# EasyEDA Pro project Button(EasyEDA_PRO).eprj

# Schematic Schematic1
Board Name: Board1; Create Date: 2026-04-25; Page Name: P1; Project Name: Button_QuattroBox; Schematic Name: Schematic1; Update Date: 2026-04-25; Company: EasyEDA.com; Page Size: A4; Version: V1.0
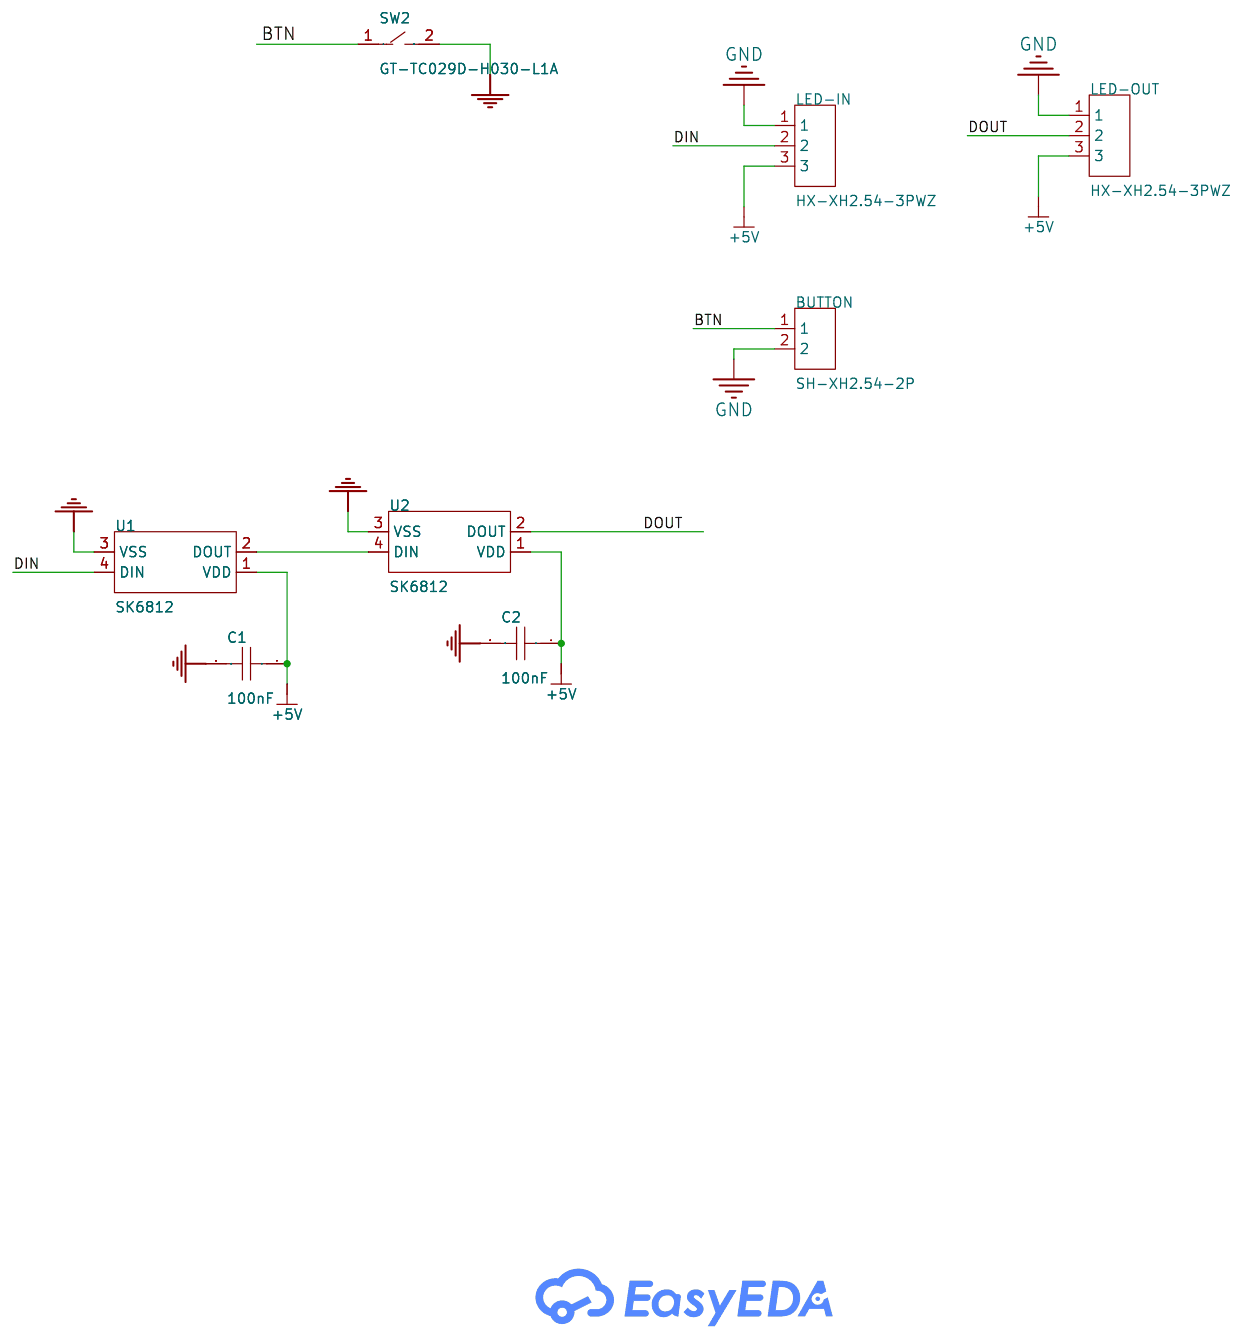
[diagram p0: schematic sheet]

## Parts
BUTTON  SH-XH2.54-2P  [CONN-TH_2P-P2.50-XH2.54-2P]
C1  100nF  [C0603]
C2  100nF  [C0603]
LED-IN  HX-XH2.54-3PWZ  [CONN-TH_3P-P2.50_BX-HA2.54-3PWZ]
LED-OUT  HX-XH2.54-3PWZ  [CONN-TH_3P-P2.50_BX-HA2.54-3PWZ]
SW2  GT-TC029D-H030-L1A  [SW-SMD_GT-TC029D-H030-L1A]
U1  SK6812  [LED-SMD_4P-L5.0-W5.0-LS5.4-TL-1]
U2  SK6812  [LED-SMD_4P-L5.0-W5.0-LS5.4-TL-1]

## Library data of the parts
BUTTON = SH-XH2.54-2P: LCSC Part Name: 1x2P 间距:2.5mm 直插; Supplier Part: C53261323; Manufacturer: 深海电子; Supplier Footprint: 插件,P=2.5mm; JLCPCB Part Class: Extended Part; Datasheet: https://item.szlcsc.com/datasheet/SH-XH2.54-2P/56320007.html; Supplier: LCSC; Pins Structure: 1x2P; Pitch: 2.5mm; Mounting Type: Through Hole; Number of Pins: 2P; Number of Rows: 1; Number of PINs Per Row: 2; Current Rating: 3A; Contact Material: Brass; Contact Plating: Tin; Operating Temperature: -25℃~+85℃; Voltage Rating: 250V; Plastic Material: PA66; Flame Retardant Rating: UL94V-0; Color: White; Z-Height of the Board: 7.1mm; X-Length of Bottom Edge on Board (Spacing Line): 7.5mm; Y-Width of Bottom Edge on Board: 5.8mm
C1 C2 = CAP_0603: Supplier Footprint: 0603
LED-IN LED-OUT = HX-XH2.54-3PWZ: LCSC Part Name: 1x3P 间距:2.5mm 弯插 系列:XH; Supplier Part: C48641715; Manufacturer: hanxia(韩下); Supplier Footprint: 弯插,P=2.5mm; JLCPCB Part Class: Extended Part; Datasheet: https://item.szlcsc.com/datasheet/HX-XH2.54-3PWZ/50919911.html; Supplier: LCSC; Pins Structure: 1x3P; Pitch: 2.5mm; Mounting Type: Right Angle; Reference Series: XH; Number of Pins: 3P; Number of Rows: 1; Number of PINs Per Row: 3; Current Rating: 3A; Contact Material: Brass; Contact Plating: Tin; Operating Temperature: -25℃~+85℃; Voltage Rating: 250V; Plastic Material: PA66; Flame Retardant Rating: UL94V-0; Color: White
SW2 = GT-TC029D-H030-L1A: LCSC Part Name: 立贴轻触开关; Supplier Part: C51939822; Manufacturer: G-Switch(品赞); Supplier Footprint: SMD; JLCPCB Part Class: Extended Part; Datasheet: https://item.szlcsc.com/datasheet/GT-TC029D-H030-L1A/54658607.html; Supplier: LCSC
U1 U2 = SK6812_C5378720: LCSC Part Name: 5.4x5.0x1.6毫米0.2W智能外控表面贴装SMD型LED; Supplier Part: C5378720; Manufacturer: 欧思科光电; Supplier Footprint: SMD-4P,5.4x5mm; JLCPCB Part Class: Extended Part; Datasheet: https://item.szlcsc.com/datasheet/SK6812/6242291.html; Supplier: LCSC; Wavelength: R:620nm~625nm；B:460nm~470nm；G:520nm~530nm; Luminous Intensity: B:160mcd~320mcd；R:280mcd~515mcd；G:815mcd~1275mcd; Fixed-Frequency Pwm Mode: 1kHz; Data Transmission Rate: 800Kbit/s; Voltage - Supply: 3.7V~5.5V; Quiescent Current: 0.6mA; Lens Color: Semi-transparent lens; ESD Withstand Voltage: 2000V; Operating Temperature: -40℃~+85℃; Viewing Angle: 120°; Height: 1.6mm

## Nets
+5V: C1.1 C2.1 LED-IN.3 LED-OUT.3 U1.1(VDD) U2.1(VDD)
GND: BUTTON.2 C1.2 C2.2 LED-IN.1 LED-OUT.1 SW2.2 U1.3(VSS) U2.3(VSS)
BTN: BUTTON.1 SW2.1
DIN: LED-IN.2 U1.4(DIN)
DOUT: LED-OUT.2 U2.2(DOUT)
$1N567: U1.2(DOUT) U2.4(DIN)

# Board PCB2
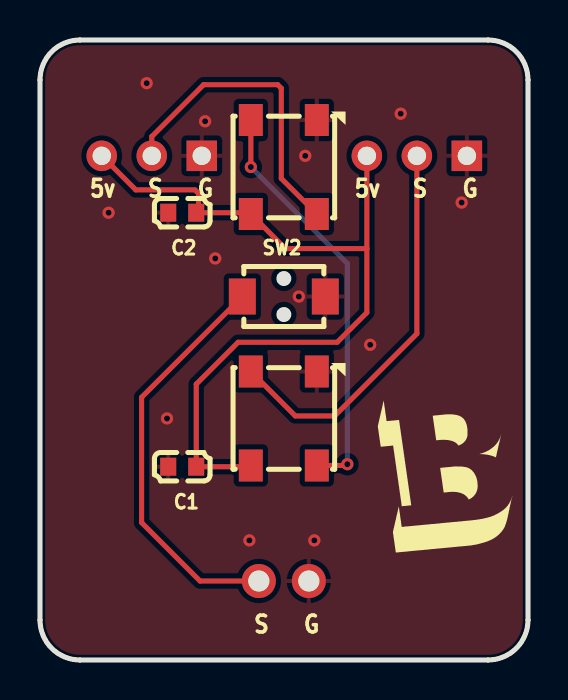
[diagram p1: board, top side]
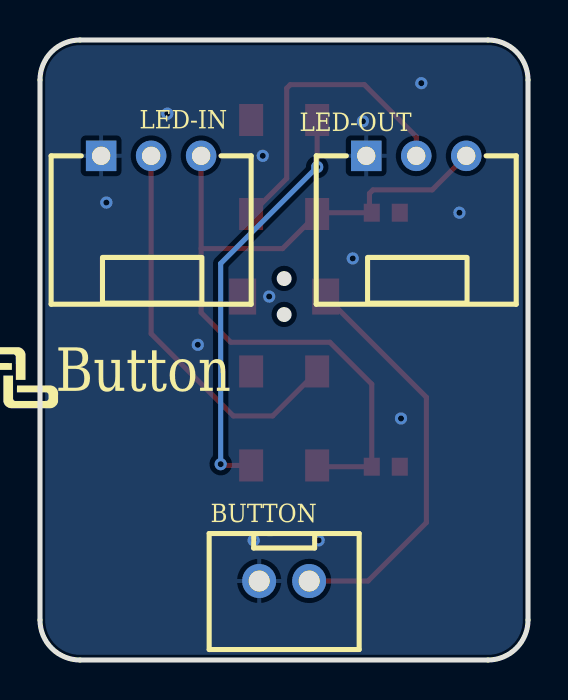
[diagram p2: board, bottom side, seen from below]

Outline 24.4 x 31 mm; copper layers: Top Layer, Bottom Layer. Coordinates in mm from the lower left corner of the outline.
Outline path: 0,29 0,2 arc(0.59,0.59) 2,0 22.4,0 arc(23.81,0.59) 24.4,2 24.4,29 arc(23.81,30.41) 22.4,31 2,31 arc(0.59,30.41) 0,29
Stack: Top Layer 0.035mm / Dielectric1 1.51mm FR4 er 4.5 / Bottom Layer 0.035mm

## Design rules (mm)
template: JLCPCB Capability(Two Layers Board)
spacing copperThickness1oz (default): track to track 0.102, other pairs 0.152 to 0.3
spacing copperThickness2oz: track to track 0.203, other pairs 0.152 to 0.3
track width copperThickness1oz (default): min 0.127, default 0.254, max 2.54
track width copperThickness2oz: min 0.203, default 0.254, max 2.54
differential pair differentialPair (default): width min 0.127, default 0.254, max 2.54; gap min 0.152, default 0.152
via viaSize (default): diameter min 0.5, default 0.61, max 10; hole min 0.3, default 0.305, max 6.3

## Placement (name value [footprint] x y rotation side)
BUTTON  SH-XH2.54-2P  [CONN-TH_2P-P2.50-XH2.54-2P]  12.19 3.95 180 bottom
C1  100nF  [C0603]  7.11 9.66 180 top
C2  100nF  [C0603]  7.11 22.36 180 top
LED-IN  HX-XH2.54-3PWZ  [CONN-TH_3P-P2.50_BX-HA2.54-3PWZ]  18.84 25.21 180 bottom
LED-OUT  HX-XH2.54-3PWZ  [CONN-TH_3P-P2.50_BX-HA2.54-3PWZ]  5.59 25.21 180 bottom
SW2  GT-TC029D-H030-L1A  [SW-SMD_GT-TC029D-H030-L1A]  12.19 18.17 0 top
U1  SK6812  [LED-SMD_4P-L5.0-W5.0-LS5.4-TL-1]  12.19 12.08 90 top
U2  SK6812  [LED-SMD_4P-L5.0-W5.0-LS5.4-TL-1]  12.19 24.65 90 top

## Footprints (pads in the part's own frame, mm; a bottom-side part is the same pattern mirrored in y, then rotated)
C0603
  rect 0.8x0.9 smd: 1(-0.7,0) 2(0.7,0)
CONN-TH_2P-P2.50-XH2.54-2P
  round 1.7 hole 1.05: 1(1.25,0) 2(-1.25,0)
CONN-TH_3P-P2.50_BX-HA2.54-3PWZ
  rect 1.524x1.524 hole 0.914: 1(-2.5,0)
  round 1.524 hole 0.914: 2(0,0) 3(2.5,0)
LED-SMD_4P-L5.0-W5.0-LS5.4-TL-1
  rect 1.6x1.2 smd: 1(-2.35,1.65) 2(-2.35,-1.65) 3(2.35,-1.65) 4(2.35,1.65)
SW-SMD_GT-TC029D-H030-L1A
  rect 1.35x1.8 smd: 1(-2.075,0) 2(2.075,0)

## Nets
As in the schematic.

## Via types
v1: diameter 0.61, hole 0.305, Top Layer to Bottom Layer, 14 vias

## Routing (per net, layer and track width the routed paths; a pad name or vN(x,y) marks a point on that pad's centre or on a via; arc(x,y) is an arc through that point)
+5V: length 40.6
  Top Layer w0.254: U1.1 10.48,9.66 C1.1 7.81,13.79 9.91,15.89 14.86,15.89 16.34,17.37 16.34,20.57 ; 16.34,20.57 12.27,20.57 U2.1 10.48,22.36 C2.1 7.93,22.48 7.93,23.33 7.75,23.51 4.79,23.51 LED-OUT.3 ; 16.34,20.57 LED-IN.3
GND:
  vias: v1(3.43,22.36) v1(5.33,28.84) v1(6.35,12.08) v1(8.25,26.94) v1(8.76,20.08) v1(10.47,5.98) v1(12.94,18.17) v1(13.26,25.21) v1(13.72,5.98) v1(16.51,15.76) v1(18.03,27.32) v1(21.08,22.87)
BTN: length 20.5
  Top Layer w0.254: 10.12,18.17 5.08,13.14 5.08,6.87 8,3.95 BUTTON.1
DIN: length 19.8
  Top Layer w0.254: 10.54,14.43 12.76,12.2 14.73,12.2 18.84,16.31 LED-IN.2
DOUT: length 15.6
  Top Layer w0.254: U2.2 12.06,24.08 12.06,28.59 11.89,28.77 8.18,28.77 5.59,26.17 LED-OUT.2
$1N567: length 20.8
  Top Layer w0.254: U2.4 10.54,24.65 ; U1.2 15.3,9.73 v1(15.37,9.79)
  Bottom Layer w0.254: v1(10.54,24.65) 15.37,19.82 v1(15.37,9.79)

## Copper pours and planes (outline as drawn; the poured copper is in the pictures)
GND on Top Layer: -1.02,32.02 25.4,32.02 25.4,-1 -1.02,-1
GND on Bottom Layer: -1.14,32.4 25.4,32.4 25.4,-1.13 -1.14,-1.13

## Text on the board
Bottom Silkscreen Layer: Button
Top Silkscreen Layer: 5v | S | G
